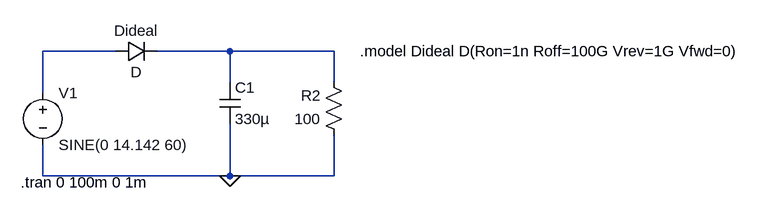
[diagram p0: schematic Exercicio19.asc]
Exercicio19.asc, the LTspice schematic file:
Version 4
SHEET 1 1116 680
WIRE 96 32 -16 32
WIRE 272 32 160 32
WIRE 432 32 272 32
WIRE 272 80 272 32
WIRE 432 80 432 32
WIRE -16 96 -16 32
WIRE -16 224 -16 176
WIRE 272 224 272 144
WIRE 272 224 -16 224
WIRE 432 224 432 160
WIRE 432 224 272 224
FLAG 272 224 0
SYMBOL voltage -16 80 R0
WINDOW 123 0 0 Left 0
WINDOW 39 0 0 Left 0
SYMATTR InstName V1
SYMATTR Value SINE(0 14.142 60)
SYMBOL res 448 176 R180
WINDOW 0 36 76 Left 2
WINDOW 3 36 40 Left 2
SYMATTR InstName R2
SYMATTR Value 100
SYMBOL cap 256 80 R0
SYMATTR InstName C1
SYMATTR Value 330µ
SYMBOL diode 96 48 R270
WINDOW 0 32 32 VTop 2
WINDOW 3 0 32 VBottom 2
SYMATTR InstName Dideal
TEXT 472 32 Left 2 !.model Dideal D(Ron=1n Roff=100G Vrev=1G Vfwd=0)
TEXT -50 234 Left 2 !.tran 0 100m 0 1m

The netlist it stands for:
* Exercicio19.asc
V1 N001 0 SINE(0 14.142 60)
R2 0 N002 100
C1 N002 0 330µ
Dideal N001 N002 D
.model D D
.lib standard.dio
.model Dideal D(Ron=1n Roff=100G Vrev=1G Vfwd=0)
.tran 0 100m 0 1m
.backanno
.end